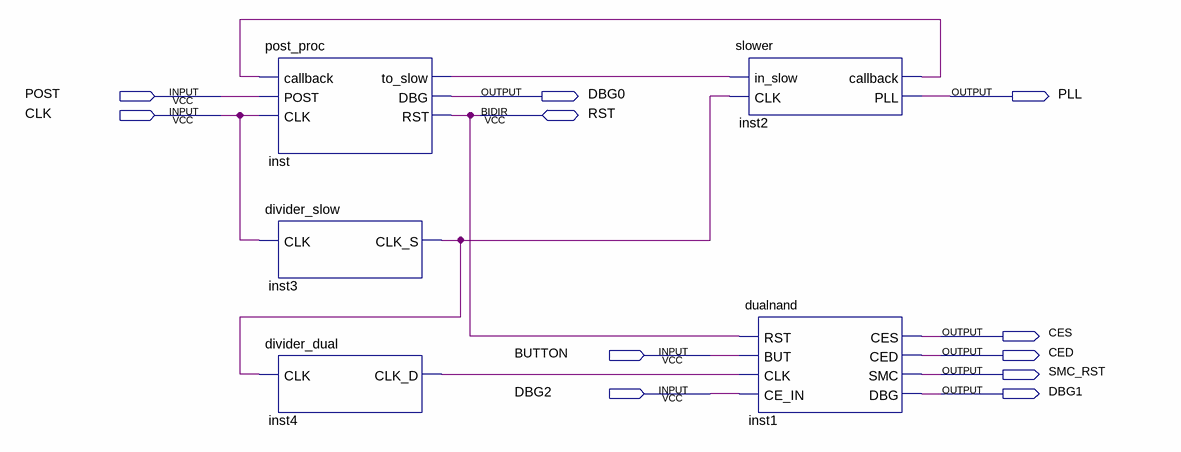
[diagram p0: schematic sheet]
// Quartus schematic main.bdf as structural Verilog: 5 symbols, 11 pins
module main (
  input  POST,
  input  CLK,
  input  BUTTON,
  input  DBG2,
  inout  RST,
  output DBG0,
  output PLL,
  output CES,
  output CED,
  output SMC_RST,
  output DBG1
);

  wire inst2_callback, inst3_clk_s, inst4_clk_d, inst_to_slow;

  post_proc inst (.callback(inst2_callback), .POST(POST), .CLK(CLK), .to_slow(inst_to_slow), .DBG(DBG0), .RST(RST));
  divider_slow inst3 (.CLK(CLK), .CLK_S(inst3_clk_s));
  divider_dual inst4 (.CLK(inst3_clk_s), .CLK_D(inst4_clk_d));
  slower inst2 (.in_slow(inst_to_slow), .CLK(inst3_clk_s), .callback(inst2_callback), .PLL(PLL));
  dualnand inst1 (
    .RST(RST), .BUT(BUTTON), .CLK(inst4_clk_d), .CE_IN(DBG2), .CES(CES), .CED(CED), .SMC(SMC_RST), .DBG(DBG1));
endmodule
